# EAGLE design breakout (EAGLE 6.1)
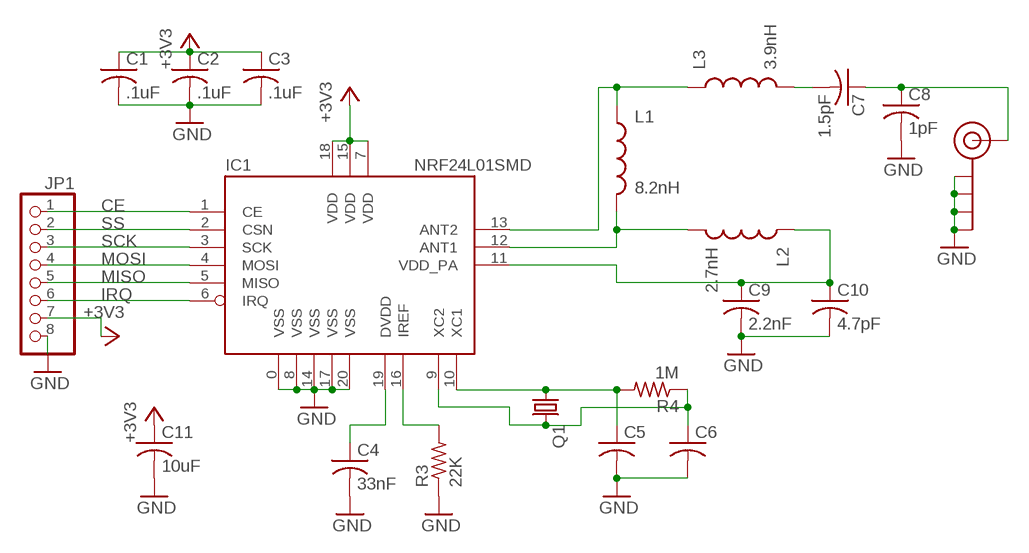
[diagram p0: schematic, sheet 1]

## Parts
C1  .1uF  C-USC0402  [C0402]
C2  .1uF  C-USC0402  [C0402]
C3  .1uF  C-USC0402  [C0402]
C4  33nF  C-USC0402  [C0402]
C5  C-USC0402  [C0402]
C6  C-USC0402  [C0402]
C7  1.5pF  C-USC0402  [C0402]
C8  1pF  C-USC0402  [C0402]
C9  2.2nF  C-USC0402  [C0402]
C10  4.7pF  C-USC0402  [C0402]
C11  10uF  C-USC0805K  [C0805K]
IC1  NRF24L01SMD  [QFN20]
J$1  SMA_EDGE  [SMA-EDGE]
JP1  PINHD-1X8  [1X08]
L1  8.2nH  INDUCTOR0402  [C0402]
L2  2.7nH  INDUCTOR0402  [C0402]
L3  3.9nH  INDUCTOR0402  [C0402]
Q1  CRYSTALHC49U-V  [HC49U-V]
R3  22K  R-US_R0402  [R0402]
R4  1M  R-US_R0402  [R0402]

## Nets
+3V3: C1.1 C2.1 C3.1 C11.1 IC1.7(VDD) IC1.15(VDD) IC1.18(VDD) JP1.7
CE: IC1.1(CE) JP1.1
GND: C1.2 C2.2 C3.2 C4.2 C5.2 C6.2 C8.2 C9.2 C10.2 C11.2 IC1.0(VSS) IC1.8(VSS) IC1.14(VSS) IC1.17(VSS) IC1.20(VSS) J$1.GND@0(GND) J$1.GND@1(GND) J$1.GND@2(GND) J$1.GND@3(GND) JP1.8 R3.1
IRQ: IC1.6(IRQ) JP1.6
MISO: IC1.5(MISO) JP1.5
MOSI: IC1.4(MOSI) JP1.4
N$10: C4.1 IC1.19(DVDD)
N$11: IC1.16(IREF) R3.2
N$12: C5.1 IC1.10(XC1) Q1.1 R4.2
N$13: C6.1 IC1.9(XC2) Q1.2 R4.1
N$14: IC1.13(ANT2) L1.1 L3.1
N$15: IC1.12(ANT1) L1.2 L2.2
N$16: C7.2 L3.2
N$17: C7.1 C8.1 J$1.SIG(SIGNAL)
N$18: C9.1 C10.1 IC1.11(VDD_PA) L2.1
SCK: IC1.3(SCK) JP1.3
SS: IC1.2(CSN) JP1.2

## Library data of the parts
C1-C11 = adafruit:C-US: CAPACITOR, American symbol
IC1 = SparkFun:NRF24L01: 2.4GHz Low Power Transceiver This is the very popular, low cost, very low power RF transceiver from Nordic Semiconductor. Simple SPI interface. SKU: COM-00690
J$1 = SparkFun:SMA_EDGE: SMA Antenna Connector End launch SMA connector. The paste layer has been removed so that the connector can be hand soldered onto the board after reflow.
JP1 = pinhead:PINHD-1X8: PIN HEADER
L1-L3 = SparkFun:INDUCTOR: Inductors Basic Inductor/Choke - 0603 and 1206. Footprints are not proven and vary greatly between part numbers.
Q1 = crystal:CRYSTAL: CRYSTAL; OC_FARNELL: 1666969; OC_NEWARK: unknown
R3 R4 = adafruit:R-US_: RESISTOR, American symbol

## Board
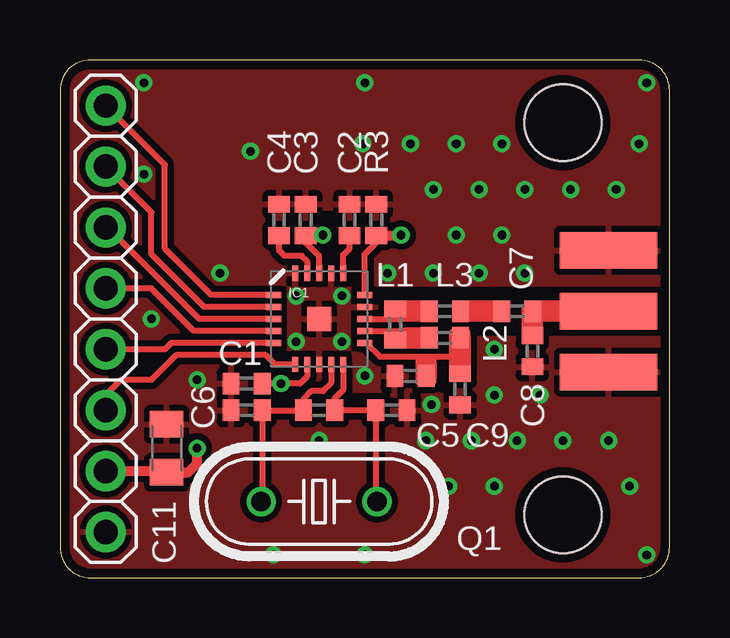
[diagram p1: board, top side]
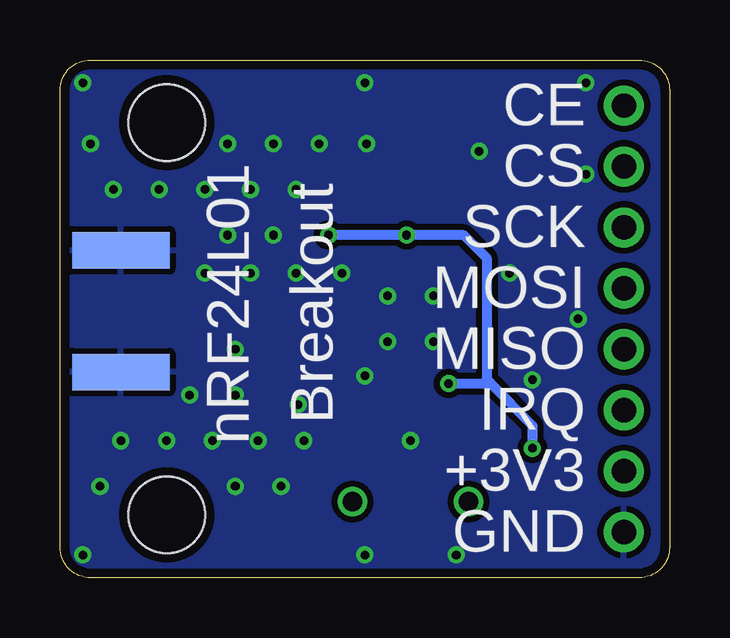
[diagram p2: board, bottom side, seen from below]

Size 25.4 x 21.59 mm. Coordinates in mm from the lower left corner, seen from the top.
Outline: 0,20.32 0,1.27 arc90 1.27,0 24.13,0 arc90 25.4,1.27 25.4,20.32 arc90 24.13,21.59 1.27,21.59 arc90 0,20.32
Copper layers (1*16): Top 0.0356mm / dielectric 1.5011mm / Bottom 0.0356mm
Design rules: minimum track width 6mil, minimum drill 13mil, track to track 6mil, track to pad 6mil, pad to pad 6mil, via to via 6mil, smd to smd 6mil, copper to edge 15mil, drill to drill 6mil, minimum pad ring 7mil, minimum via ring 7mil, stop-mask expansion 4mil, vias tented up to drill 20mil, thermal gap 10mil
Holes 3.2 mm at 20.95,2.62 20.95,18.97
tRestrict: 9 lines
bRestrict: 2 lines

### Footprints (pad centres in the part's own frame; a part is rotated, then mirrored left to right if it is on the bottom)
C0402 = smd 0.7 x 0.9: 1 -0.65,0; 2 0.65,0
C0805K = smd 1.1 x 1.4: 1 -1,0; 2 1,0
QFN20 = smd 1 x 1: 0 0,0 | smd 0.637 x 0.254: 1 -1.9,1; 2 -1.9,0.5; 3 -1.9,0; 4 -1.9,-0.5; 5 -1.9,-1; 11 1.9,-1; 12 1.9,-0.5; 13 1.9,0; 14 1.9,0.5; 15 1.9,1 | smd 0.254 x 0.637: 6 -1,-1.9; 7 -0.5,-1.9; 8 0,-1.9; 9 0.5,-1.9; 10 1,-1.9; 16 1,1.9; 17 0.5,1.9; 18 0,1.9; 19 -0.5,1.9; 20 -1,1.9
SMA-EDGE = smd 1.524 x 4.064: GND@0 0,0; GND@1 5.08,0; SIG 2.54,0 | smd 1.524 x 4.064 bottom: GND@2 0,0; GND@3 5.08,0
1X08 = drill 1.016 pad 1.676: 1 -8.89,0; 2 -6.35,0; 3 -3.81,0; 4 -1.27,0; 5 1.27,0; 6 3.81,0; 7 6.35,0; 8 8.89,0
HC49U-V = drill 0.813: 1 -2.413,0; 2 2.413,0
R0402 = smd 0.7 x 0.9: 1 -0.65,0; 2 0.65,0

### Placement (x,y rotation side)
C1  7.78,8.1 180 top
C2  13.18,14.92 90 top
C3  10.24,14.92 90 top
C4  9.13,14.92 90 top
C5  13.81,6.99 0 top
C6  7.78,6.99 180 top
C7  19.05,11.11 180 top
C8  19.68,9.45 270 top
C9  16.67,7.86 270 top
C10  14.61,8.41 180 top
C11  4.45,5.4 90 top
IC1  10.79,10.79 0 top
J$1  22.86,8.57 90 top
JP1  1.91,10.79 270 top
L1  13.97,10.56 270 top
L2  16.03,10 180 top
L3  16.03,11.11 0 top
Q1  10.79,3.17 180 top
R3  12.06,14.92 270 top
R4  10.79,6.99 0 top

### Tracks (layer width: path | path; a pad name or v marks a point on that pad's centre or on a via)
+3V3  (via drill 0.36)
  Top 0.254: IC1.7 10.29,8.39 10,8.1 v9.21,8.1 C1.1 | IC1.15 12.7,13.49 13.18,13.97 C2.1 | IC1.18 10.79,13.41 10.24,13.97 C3.1
  Top 0.406: JP1.7 4.4,4.45 C11.1 5.35,4.4 5.71,4.76 v5.71,5.4 | C2.1 14.19,14.27 v14.21,14.29 | C3.1 10.94,14.27 v10.95,14.29
  Bottom 0.406: v9.21,8.1 7.46,8.1 | 7.46,8.1 5.71,6.35 v5.71,5.4 | 7.46,8.1 7.62,8.26 7.62,13.34 8.57,14.29 v10.95,14.29 v14.21,14.29
CE
  Top 0.254: IC1.1 6.3,11.79 4.37,13.73 4.37,17.22 JP1.1
GND  (via drill 0.36)
  other vias: 9.84,11.75 11.75,11.75 9.84,9.84 11.75,9.84 12.7,8.41 13.65,12.7 15.56,12.7 17.46,12.7 19.37,12.7 18.1,9.53 18.1,7.62 16.51,14.29 18.41,14.29 19.37,16.19 17.46,16.19 15.56,16.19 21.27,16.19 23.18,16.19 24.13,18.1 18.41,18.1 16.51,18.1 14.61,18.1 12.62,18.1 20,7.62 19.05,5.71 20.95,5.71 22.86,5.71 17.14,5.71 15.24,5.71 15.48,7.22 18.1,3.81 23.73,3.81 16.19,3.81 24.45,0.95 12.7,0.95 12.7,20.64 24.45,20.64 3.49,20.64 6.67,12.7 7.94,17.78 5.71,8.26 10.79,5.71 8.89,0.95 3.81,10.79 3.49,16.83
  pour Bottom (isolate 0.254): 0,0 25.4,0 25.4,21.59 0,21.59
  pour Top (isolate 0.254): 0,0 25.4,0 25.4,21.59 0,21.59
IRQ
  Top 0.254: IC1.6 8.96,8.89 8.57,9.29 4.84,9.29 3.81,8.26 2.54,8.26 1.91,7.62 JP1.6
MISO
  Top 0.254: IC1.5 4.64,9.79 4.37,9.53 JP1.5
MOSI
  Top 0.254: IC1.4 5.58,10.29 3.81,12.06 JP1.4
N$10
  Top 0.254: IC1.19 10.29,13.2 10.08,13.41 9.37,13.41 9.13,13.65 C4.1
N$11
  Top 0.254: IC1.16 11.79,13.46 12.06,13.73 R3.2
N$12
  Top 0.254: IC1.10 11.79,7.83 11.43,7.46 11.43,7 R4.2 C5.1 13.16,3.22 Q1.1
N$13
  Top 0.254: IC1.9 11.29,8.12 10.95,7.78 10.48,7.78 10.16,7.46 10.16,7 R4.1 C6.1 8.43,3.22 Q1.2
N$14
  Top 0.254: L3.1 15.24,11.11 | 14.45,11.11 14.06,11.11 14.02,11.16 | 14.02,11.16 L1.1 | IC1.13 14.29,10.79 | 14.61,10.79 14.29,10.79 | 14.29,10.79 13.97,11.11 14.02,11.16
  Top 0.889: 15.24,11.11 14.45,11.11
N$15
  Top 0.254: L2.2 15.24,10 | 14.45,10 14.13,10 13.97,9.84 | 13.97,9.84 L1.2 | IC1.12 14.47,10.29 14.61,10.16 14.29,9.84 13.97,9.84
  Top 0.889: 15.24,10 14.45,10
N$16
  Top 0.254: 18.26,11.11 C7.2 | C7.2 18.41,11.11 | C7.2 L3.2
  Top 0.61: L3.2 16.75,11.11
  Top 0.813: 16.75,11.11 16.83,11.11
  Top 0.889: 16.83,11.11 18.26,11.11
N$17
  Top 0.254: C7.1 19.84,11.11 | C8.1 19.68,10.24
  Top 0.889: 19.84,11.11 J$1.SIG | 19.68,10.24 19.68,11.11 C7.1
N$18
  Top 0.254: IC1.11 12.75,9.79 13.34,9.21 14.92,9.21 | 16.67,9.99 L2.1 | 16.68,9.21 15.56,9.21 | 15.56,9.21 15.24,9.21 | 15.24,9.21 14.92,9.21 | C9.1 16.67,8.65 16.35,8.33 16.35,10.24 16.43,10.32 | C10.1 15.26,9.19 15.24,9.21 | 14.92,9.21 14.92,8.18 15,8.1 | 15.56,9.21 15.56,8.18 15.48,8.1 | 16.91,10.32 16.99,10.24 16.99,9.84 16.68,9.84
  Top 0.889: L2.1 16.68,9.84 16.68,9.21 16.68,8.67 16.67,8.65 | C10.1 15.26,8.88
SCK
  Top 0.254: IC1.3 5.79,10.79 1.98,14.61 JP1.3
SS
  Top 0.254: IC1.2 6.01,11.29 3.81,13.49 3.81,15.24 JP1.2

### Text on the board
bNames: CE | CS | SCK | MOSI | Breakout | nRF24L01 | MISO | IRQ | +3V3 | GND